# EAGLE design art_limb (EAGLE 7.6.0)
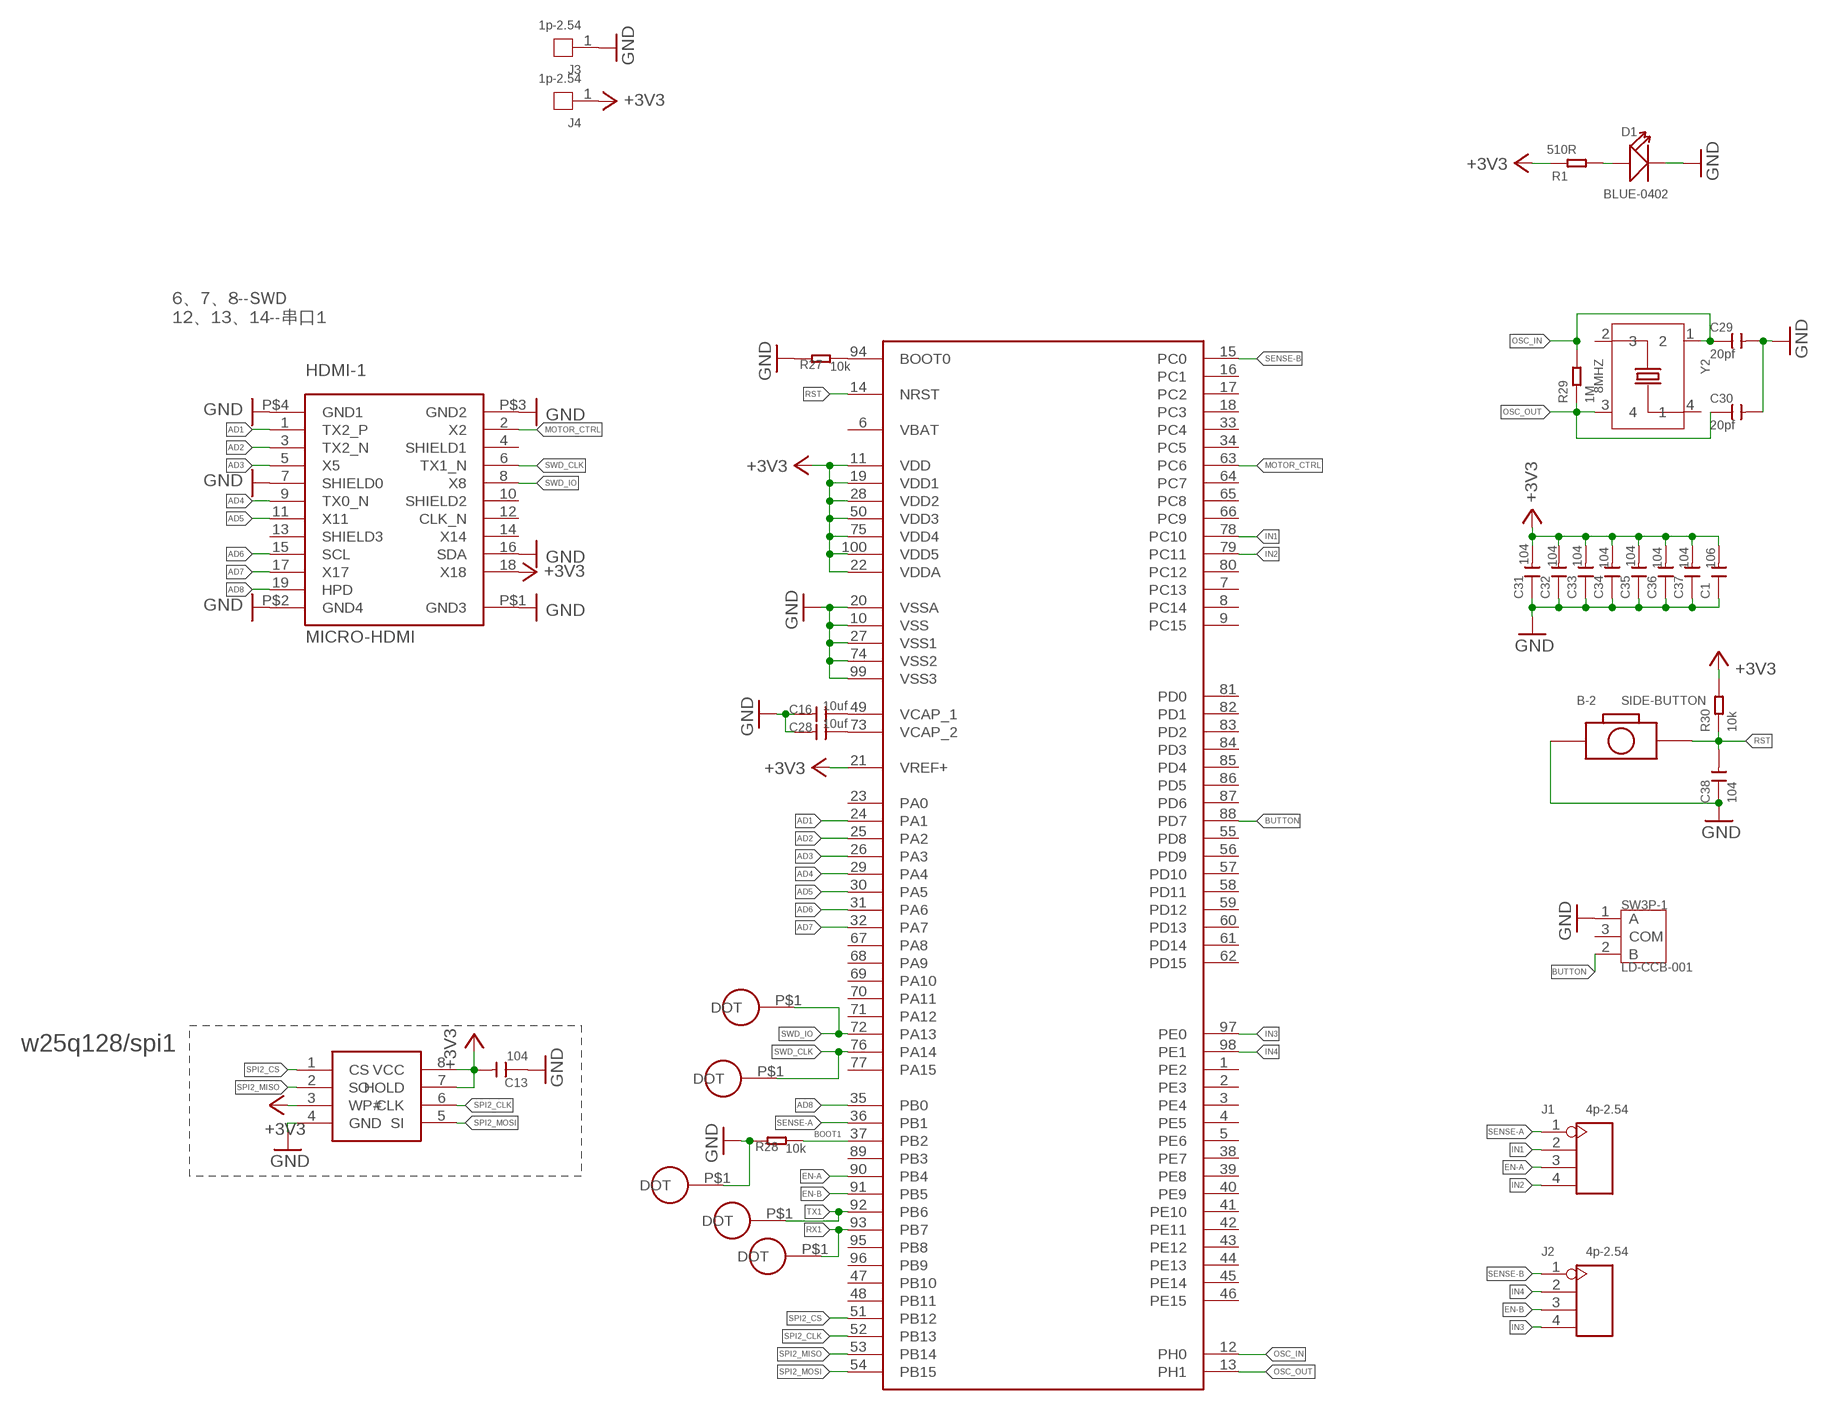
[diagram p0: schematic, sheet 1]

## Parts
B-2  SIDE-BUTTON  [SIDE-BUTTON]
C1  106  CAP-(0402)  [C0402]
C13  104  CAP-(0402)  [C0402]
C16  10uf  CAP-(0402)  [C0402]
C28  10uf  CAP-(0402)  [C0402]
C29  20pf  CAP-(0402)  [C0402]
C30  20pf  CAP-(0402)  [C0402]
C31  104  CAP-(0402)  [C0402]
C32  104  CAP-(0402)  [C0402]
C33  104  CAP-(0402)  [C0402]
C34  104  CAP-(0402)  [C0402]
C35  104  CAP-(0402)  [C0402]
C36  104  CAP-(0402)  [C0402]
C37  104  CAP-(0402)  [C0402]
C38  104  CAP-(0402)  [C0402]
D1  BLUE-0402  LED-(0402)  [LED-0402]
HDMI-1  MICRO-HDMI  [HDMI]
J1  4p-2.54  DIP-BLACK-FEMALE-HEADER-VERT(4P-2.54)  [H4-2.54]
J2  4p-2.54  DIP-BLACK-FEMALE-HEADER-VERT(4P-2.54)  [H4-2.54]
J3  1p-2.54  DIP-BLACK-ROUND-FEMALE-HEADER-VERT(1P-2.54)  [1P-65/35MIL]
J4  1p-2.54  DIP-BLACK-ROUND-FEMALE-HEADER-VERT(1P-2.54)  [1P-65/35MIL]
R1  510R  RES-(0402)  [R0402]
R27  10k  RES-(0402)  [R0402]
R28  10k  RES-(0402)  [R0402]
R29  1M  RES-(0402)  [R0402]
R30  10k  RES-(0402)  [R0402]
SW3P-1  LD-CCB-001  SWITCH(3P)  [SW3-2.54-9.0X3.5X3.5+2.0MM]
U$1  STM32F40XSTM32D40X  [LQFP100]
U$2  TEST-POINT  [TEST-POINT]
U$3  TEST-POINT  [TEST-POINT]
U$4  TEST-POINT  [TEST-POINT]
U$5  TEST-POINT  [TEST-POINT]
U$6  TEST-POINT  [TEST-POINT]
W25Q128  W25Q128  [SOP08]
Y2  8MHZ  SMD-CRYSTAL-27.12MHZ-18PF-30PPM-60R(4P-3.2X2.5MM)  [X4-SMD-3.2X2.5X0.7MM]

## Nets
+3V3: C1.2 C13.2 C31.2 C32.2 C33.2 C34.2 C35.2 C36.2 C37.2 HDMI-1.18(X18) J4.1 R1.2 R30.2 U$1.11(VDD) U$1.19(VDD1) U$1.21(VREF+) U$1.22(VDDA) U$1.28(VDD2) U$1.50(VDD3) U$1.75(VDD4) U$1.100(VDD5) W25Q128.3(WP#) W25Q128.7(HOLD) W25Q128.8(VCC)
AD1: HDMI-1.1(TX2_P) U$1.24(PA1)
AD2: HDMI-1.3(TX2_N) U$1.25(PA2)
AD3: HDMI-1.5(X5) U$1.26(PA3)
AD4: HDMI-1.9(TX0_N) U$1.29(PA4)
AD5: HDMI-1.11(X11) U$1.30(PA5)
AD6: HDMI-1.15(SCL) U$1.31(PA6)
AD7: HDMI-1.17(X17) U$1.32(PA7)
AD8: HDMI-1.19(HPD) U$1.35(PB0)
BOOT1: R28.2 U$1.37(PB2)
BUTTON: SW3P-1.2(B) U$1.88(PD7)
EN-A: J1.3 U$1.90(PB4)
EN-B: J2.3 U$1.91(PB5)
GND: B-2.P$2 C1.1 C13.1 C16.2 C28.2 C29.2 C30.2 C31.1 C32.1 C33.1 C34.1 C35.1 C36.1 C37.1 C38.1 D1.- HDMI-1.7(SHIELD0) HDMI-1.16(SDA) HDMI-1.P$1(GND3) HDMI-1.P$2(GND4) HDMI-1.P$3(GND2) HDMI-1.P$4(GND1) J3.1 R27.1 R28.1 SW3P-1.1(A) U$1.10(VSS) U$1.20(VSSA) U$1.27(VSS1) U$1.74(VSS2) U$1.99(VSS3) U$4.P$1(DOT) W25Q128.4(GND)
IN1: J1.2 U$1.78(PC10)
IN2: J1.4 U$1.79(PC11)
IN3: J2.4 U$1.97(PE0)
IN4: J2.2 U$1.98(PE1)
MOTOR_CTRL: HDMI-1.2(X2) U$1.63(PC6)
N$1: D1.+ R1.1
N$21: C16.1 U$1.49(VCAP_1)
N$22: C28.1 U$1.73(VCAP_2)
N$23: R27.2 U$1.94(BOOT0)
OSC_IN: C29.1 R29.2 U$1.12(PH0) Y2.1
OSC_OUT: C30.1 R29.1 U$1.13(PH1) Y2.3
RST: B-2.P$1 C38.2 R30.1 U$1.14(NRST)
RX1: U$1.93(PB7) U$2.P$1(DOT)
SENSE-A: J1.1 U$1.36(PB1)
SENSE-B: J2.1 U$1.15(PC0)
SPI2_CLK: U$1.52(PB13) W25Q128.6(CLK)
SPI2_CS: U$1.51(PB12) W25Q128.1(CS)
SPI2_MISO: U$1.53(PB14) W25Q128.2(SO)
SPI2_MOSI: U$1.54(PB15) W25Q128.5(SI)
SWD_CLK: HDMI-1.6(TX1_N) U$1.76(PA14) U$6.P$1(DOT)
SWD_IO: HDMI-1.8(X8) U$1.72(PA13) U$5.P$1(DOT)
TX1: U$1.92(PB6) U$3.P$1(DOT)
Unconnected: HDMI-1.4(SHIELD1) HDMI-1.10(SHIELD2) HDMI-1.12(CLK_N) HDMI-1.13(SHIELD3) HDMI-1.14(X14) SW3P-1.3(COM) U$1.1(PE2) U$1.2(PE3) U$1.3(PE4) U$1.4(PE5) U$1.5(PE6) U$1.6(VBAT) U$1.7(PC13) U$1.8(PC14) U$1.9(PC15) U$1.16(PC1) U$1.17(PC2) U$1.18(PC3) U$1.23(PA0) U$1.33(PC4) U$1.34(PC5) U$1.38(PE7) U$1.39(PE8) U$1.40(PE9) U$1.41(PE10) U$1.42(PE11) U$1.43(PE12) U$1.44(PE13) U$1.45(PE14) U$1.46(PE15) U$1.47(PB10) U$1.48(PB11) U$1.55(PD8) U$1.56(PD9) U$1.57(PD10) U$1.58(PD11) U$1.59(PD12) U$1.60(PD13) U$1.61(PD14) U$1.62(PD15) U$1.64(PC7) U$1.65(PC8) U$1.66(PC9) U$1.67(PA8) U$1.68(PA9) U$1.69(PA10) U$1.70(PA11) U$1.71(PA12) U$1.77(PA15) U$1.80(PC12) U$1.81(PD0) U$1.82(PD1) U$1.83(PD2) U$1.84(PD3) U$1.85(PD4) U$1.86(PD5) U$1.87(PD6) U$1.89(PB3) U$1.95(PB8) U$1.96(PB9) Y2.2 Y2.4

## Notes on the sheet
- 6、7、8--SWD
  12、13、14--串口1
- w25q128/spi1

## Library data of the parts
B-2 = 1-LDA_Board:SIDE-BUTTON
C1 C13 C16 C28-C38 = 1-LDA_Board:CAP-(0402): 302010041; MPN: GRM1555C1H150JA01D; VALUE: 15pf
D1 = 1-LDA_Board:LED-(0402): 304090075; MPN: BL-HB337A-AV-TRB
HDMI-1 = 1-LDA_Board:MICRO-HDMI
J1 J2 = Seeed-OPL-Connector:DIP-BLACK-FEMALE-HEADER-VERT(4P-2.54): 320030017; MPN: F185-1104A1BSYA1
J3 J4 = Seeed-OPL-Connector:DIP-BLACK-ROUND-FEMALE-HEADER-VERT(1P-2.54): 320030026; MPN: RF130-1013BBS0741
R1 R27-R30 = 1-LDA_Board:RES-(0402): 301010000; MPN: RC0402JR-070RL; VALUE: 0R
SW3P-1 = 1-LDA_Board:SWITCH(3P): 311030006; MPN: LD-CCB-001
U$1 = 1-LDA_Board:STM32F40X: Features • Core: ARM 32-bit Cortex™-M4 CPU with FPU, Adaptive real-time accelerator (ART Accelerator™) allowing 0-wait state execution from Flash memory, frequency up to 168 MHz, memory protection unit, 210 DMIPS/ 1.25 DMIPS/MHz (Dhrystone 2.1), and DSP instructions • Memories – Up to 1 Mbyte of Flash memory – Up to 192+4 Kbytes of SRAM including 64- Kbyte of CCM (core coupled memory) data RAM – Flexible static memory controller supporting Compact Flash, SRAM, PSRAM, NOR and NAND memories • LCD parallel interface, 8080/6800 modes • Clock, reset and supply management – 1.8 V to 3.6 V application supply and I/Os – POR, PDR, PVD and BOR – 4-to-26 MHz crystal oscillator – Internal 16 MHz factory-trimmed RC (1% accuracy) – 32 kHz oscillator for RTC with calibration – Internal 32 kHz RC with calibration • Low power – Sleep, Stop and Standby modes – VBAT supply for RTC, 20×32 bit backup registers + optional 4 KB backup SRAM • 3×12-bit, 2.4 MSPS A/D converters: up to 24 channels and 7.2 MSPS in triple interleaved mode • 2×12-bit D/A converters • General-purpose DMA: 16-stream DMA controller with FIFOs and burst support • Up to 17 timers: up to twelve 16-bit and two 32- bit timers up to 168 MHz, each with up to 4 IC/OC/PWM or pulse counter and quadrature (incremental) encoder input • Debug mode – Serial wire debug (SWD) & JTAG interfaces – Cortex-M4 Embedded Trace Macrocell™ • Up to 140 I/O ports with interrupt capability – Up to 136 fast I/Os up to 84 MHz – Up to 138 5 V-tolerant I/Os • Up to 15 communication interfaces – Up to 3 × I2C interfaces (SMBus/PMBus) – Up to 4 USARTs/2 UARTs (10.5 Mbit/s, ISO 7816 interface, LIN, IrDA, modem control) – Up to 3 SPIs (42 Mbits/s), 2 with muxed full-duplex I2S to achieve audio class accuracy via internal audio PLL or external clock – 2 × CAN interfaces (2.0B Active) – SDIO interface • Advanced connectivity – USB 2.0 full-speed device/host/OTG controller with on-chip PHY – USB 2.0 high-speed/full-speed device/host/OTG controller with dedicated DMA, on-chip full-speed PHY and ULPI – 10/100 Ethernet MAC with dedicated DMA: supports IEEE 1588v2 hardware, MII/RMII • 8- to 14-bit parallel camera interface up to 54 Mbytes/s • True random number generator • CRC calculation unit • 96-bit unique ID • RTC: subsecond accuracy, hardware calendar
U$2-U$6 = 1-BT4:TEST-POINT
W25Q128 = 1-LDA_Board:W25Q128
Y2 = 1-LDA_Board:SMD-CRYSTAL-27.12MHZ-18PF-30PPM-60R(4P-3.2X2.5MM): 306010027; MPN: 7M-27.120MAAJ-T; VALUE: 27.12MHZ

## Board
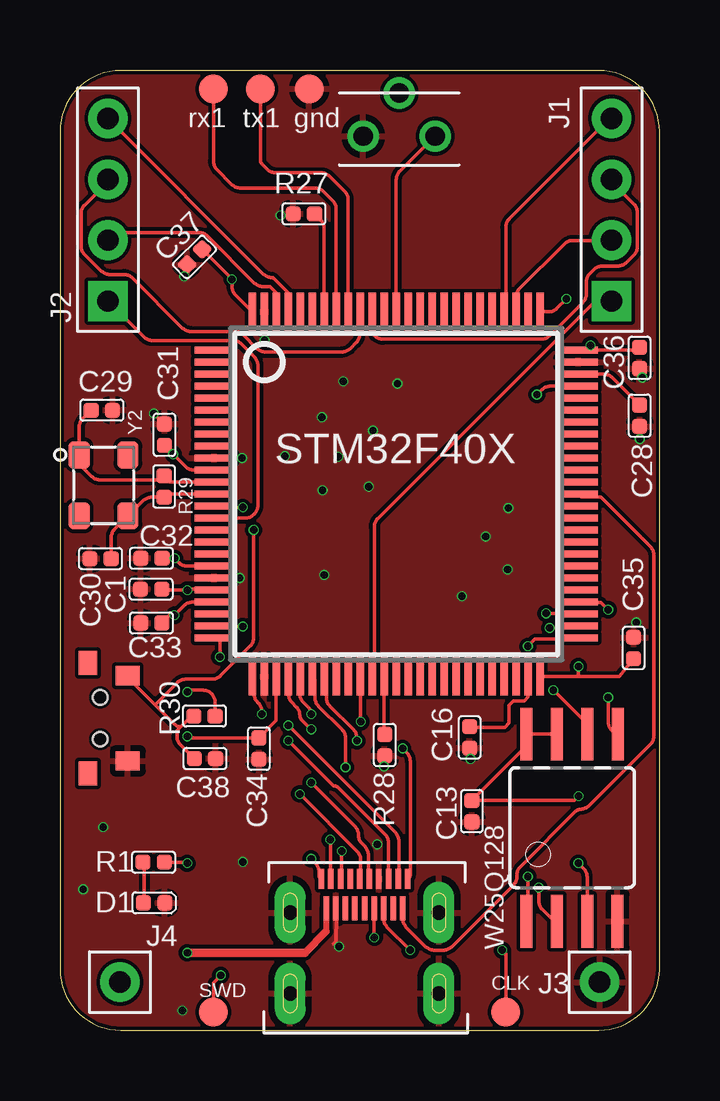
[diagram p1: board, top side]
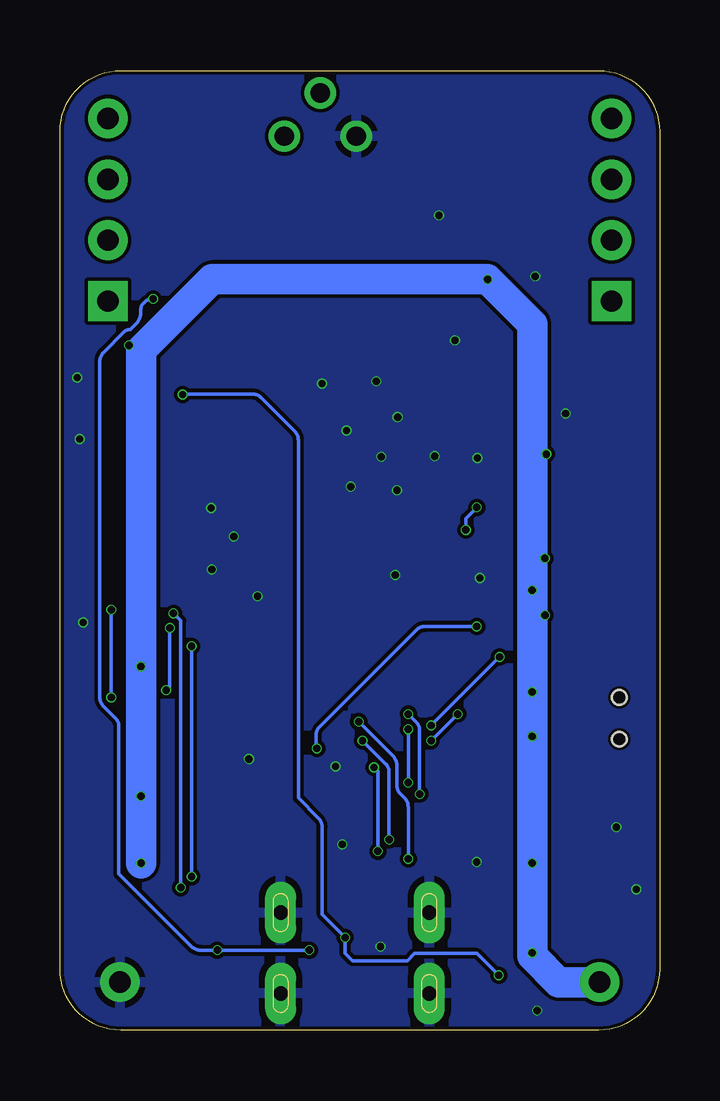
[diagram p2: board, bottom side, seen from below]

Size 25 x 40 mm. Coordinates in mm from the lower left corner, seen from the top.
Outline: 25,2.54 25,37.46 arc90 22.46,40 2.54,40 arc90 0,37.46 0,2.54 arc90 2.54,0 22.46,0 arc90 25,2.54
Copper layers (1*16): Top 0.035mm / dielectric 1.5mm / Bottom 0.035mm
Design rules "default *": minimum track width 6mil, minimum drill 12mil, track to track 6mil, track to pad 6mil, pad to pad 6mil, via to via 6mil, smd to smd 6mil, copper to edge 6mil, drill to drill 8mil, minimum pad ring 10mil, minimum via ring 2mil, stop-mask expansion 4mil, vias tented up to drill 12mil, thermal gap 10mil

### Footprints (pad centres in the part's own frame; a part is rotated, then mirrored left to right if it is on the bottom)
SIDE-BUTTON = smd 0.8 x 1: P$1 -1.778,1.15; P$2 1.778,1.15 | smd 1 x 0.762: P$3 2.3,-0.508; P$4 -2.3,-0.508 | hole 0.6: 0.87,0; -0.87,0
C0402 = smd 0.635 x 0.635: 1 0,0.445; 2 0,-0.445
LED-0402 = smd 0.635 x 0.635: + -0.445,0; - 0.445,0
HDMI = smd 0.23 x 0.85: 1 1.8,1.225; 3 1.4,1.225; 5 1,1.225; 7 0.6,1.225; 9 0.2,1.225; 11 -0.2,1.225; 13 -0.6,1.225; 15 -1,1.225; 17 -1.4,1.225; 19 -1.8,1.225 | smd 0.23 x 1: 2 1.6,0; 4 1.2,0; 6 0.8,0; 8 0.4,0; 10 0,0; 12 -0.4,0; 14 -0.8,0; 16 -1.2,0; 18 -1.6,0 | drill 0.6 pad 1.3 long: P$1 -3.1,-0.18; P$2 3.1,-0.18; P$3 -3.1,-3.55; P$4 3.1,-3.55
H4-2.54 = drill 0.889 pad 1.651 square: 1 0,3.81 | drill 0.889 pad 1.651: 2 0,1.27; 3 0,-1.27; 4 0,-3.81
1P-65/35MIL = drill 0.889 pad 1.651: 1 0,0
R0402 = smd 0.635 x 0.635: 1 0,0.445; 2 0,-0.445
SW3-2.54-9.0X3.5X3.5+2.0MM = drill 0.8 pad 1.3: 1 -1.5,-1.8; 2 1.5,-1.8 | drill 0.8: 3 0,0
LQFP100 = smd 1.6 x 0.3: 1 -7.6,6; 2 -7.6,5.5; 3 -7.6,5; 4 -7.6,4.5; 5 -7.6,4; 6 -7.6,3.5; 7 -7.6,3; 8 -7.6,2.5; 9 -7.6,2; 10 -7.6,1.5; 11 -7.6,1; 12 -7.6,0.5; 13 -7.6,0; 14 -7.6,-0.5; 15 -7.6,-1; 16 -7.6,-1.5; 17 -7.6,-2; 18 -7.6,-2.5; 19 -7.6,-3; 20 -7.6,-3.5; 21 -7.6,-4; 22 -7.6,-4.5; 23 -7.6,-5; 24 -7.6,-5.5; 25 -7.6,-6; 51 7.6,-6; 52 7.6,-5.5; 53 7.6,-5; 54 7.6,-4.5; 55 7.6,-4; 56 7.6,-3.5; 57 7.6,-3; 58 7.6,-2.5; 59 7.6,-2; 60 7.6,-1.5; 61 7.6,-1; 62 7.6,-0.5; 63 7.6,0; 64 7.6,0.5; 65 7.6,1; 66 7.6,1.5; 67 7.6,2; 68 7.6,2.5; 69 7.6,3; 70 7.6,3.5; 71 7.6,4; 72 7.6,4.5; 73 7.6,5; 74 7.6,5.5; 75 7.6,6 | smd 0.3 x 1.6: 26 -6,-7.6; 27 -5.5,-7.6; 28 -5,-7.6; 29 -4.5,-7.6; 30 -4,-7.6; 31 -3.5,-7.6; 32 -3,-7.6; 33 -2.5,-7.6; 34 -2,-7.6; 35 -1.5,-7.6; 36 -1,-7.6; 37 -0.5,-7.6; 38 0,-7.6; 39 0.5,-7.6; 40 1,-7.6; 41 1.5,-7.6; 42 2,-7.6; 43 2.5,-7.6; 44 3,-7.6; 45 3.5,-7.6; 46 4,-7.6; 47 4.5,-7.6; 48 5,-7.6; 49 5.5,-7.6; 50 6,-7.6; 76 6,7.6; 77 5.5,7.6; 78 5,7.6; 79 4.5,7.6; 80 4,7.6; 81 3.5,7.6; 82 3,7.6; 83 2.5,7.6; 84 2,7.6; 85 1.5,7.6; 86 1,7.6; 87 0.5,7.6; 88 0,7.6; 89 -0.5,7.6; 90 -1,7.6; 91 -1.5,7.6; 92 -2,7.6; 93 -2.5,7.6; 94 -3,7.6; 95 -3.5,7.6; 96 -4,7.6; 97 -4.5,7.6; 98 -5,7.6; 99 -5.5,7.6; 100 -6,7.6
TEST-POINT = smd 1.2 x 1.2: P$1 0,0
SOP08 = smd 0.5 x 2.2: 1 -1.905,-3.9; 2 -0.645,-3.9; 3 0.625,-3.9; 4 1.895,-3.9; 5 1.905,3.9; 6 0.635,3.9; 7 -0.635,3.9; 8 -1.905,3.9
X4-SMD-3.2X2.5X0.7MM = smd 1.143 x 0.889: 1 -1.27,-1.016; 2 1.27,-1.016; 3 1.27,1.016; 4 -1.27,1.016

### Placement (x,y rotation side)
B-2  1.68,13 270 top
C1  3.8,18.38 90 top
C13  17.18,9.13 180 top
C16  17.08,12.2 0 top
C28  24.17,25.61 0 top
C29  1.75,25.85 90 top
C30  1.69,19.66 270 top
C31  4.36,24.82 0 top
C32  3.81,19.67 90 top
C33  3.81,16.97 90 top
C34  8.29,11.73 180 top
C35  23.92,15.93 0 top
C36  24.17,28.02 180 top
C37  5.61,32.23 135 top
C38  6.05,11.32 270 top
D1  3.92,5.31 0 top
HDMI-1  12.7,5.08 0 top
J1  23,34.2 180 top
J2  2,34.2 180 top
J3  22.5,2 0 top
J4  2.5,2 0 top
R1  3.9,7 90 top
R27  10.17,34.03 90 top
R28  13.54,11.89 180 top
R29  4.34,22.66 180 top
R30  6.03,13.1 90 top
SW3P-1  14.14,39.06 0 top
U$1  14.02,22.35 0 top
U$2  6.4,39.24 0 top
U$3  8.36,39.24 0 top
U$4  10.39,39.24 0 top
U$5  6.4,0.76 0 top
U$6  18.59,0.76 0 top
W25Q128  21.35,8.44 0 top
Y2  1.82,22.71 270 top

### Tracks (layer width: path | path; a pad name or v marks a point on that pad's centre or on a via)
+3V3  (via drill 0.3 pad 0.41)
  Top 0.152: U$1.21 6.38,18.38 5.35,18.38 v5.31,18.34 4.29,18.34 C1.2 | U$1.28 9.02,12.9 C34.2 5.37,12.18 v5.31,12.24 | C35.2 23.33,14.75 U$1.50 21.62,14.75 v21.62,15.16 | C36.2 24.04,28.35 U$1.75 21.92,28.35 v22.12,28.55 | U$1.19 5.31,19.35 arc-45 4.95,19.49 v4.78,19.67 C32.2 | U$1.22 5.53,17.85 arc45 5.17,17.7 v4.78,17.3 4.58,17.3 C33.2 | U$1.11 5.6,23.35 arc-45 5.24,23.49 v4.72,24.01 C31.2 | C37.2 v7.17,31.3 7.17,31 arc45 7.32,30.65 U$1.100 | R30.2 6.47,13.66 arc90 5.96,14.17 5.38,14.17 v5.31,14.1 | R1.2 5.27,7 v5.31,6.96 | W25Q128.3 21.98,6.38 arc45 21.83,6.74 v21.61,6.96 | W25Q128.7 W25Q128.8 19.45,11.85 C13.2 21.44,9.57 v21.62,9.75
  Top 0.254: HDMI-1.18 11.1,4.12
  Top 0.305: 11.1,4.12 10.21,3.23
  Top 0.356: 10.21,3.23 v5.31,3.23
  Bottom 0.152: v4.78,19.67 4.88,19.66 5.31,19.66 | U$1.75 22.1,28.65 v22.12,28.55 | v4.78,17.3 4.88,17.37 5.31,17.37 | v4.72,24.01 4.72,24.08 5.31,24.08
  Bottom 1.27: J4.1 4.21,2 5.31,3.1 v5.31,3.23 v5.31,6.96 v5.31,12.24 v5.31,14.1 5.31,17.37 v5.31,18.34 5.31,19.66 5.31,24.08 5.31,29.44 v7.17,31.3 18.66,31.3 U$1.75 v21.62,15.16 v21.62,9.75 v21.62,6.96 v21.61,6.96
AD1  (via drill 0.3)
  Top 0.152: v14.29,11.75 14.46,11.58 arc-45 14.61,11.22 14.61,6.46 arc-67 HDMI-1.1 | v7.62,16.83 6.51,16.83 U$1.24
  Bottom 0.152: v7.62,16.83 9.78,16.83 arc-45 10.14,16.68 14.18,12.65 arc-45 14.33,12.29 14.33,11.79 v14.29,11.75
AD2  (via drill 0.3)
  Top 0.152: v9.53,12.7 13.98,8.24 arc-45 14.13,7.89 14.13,6.35 HDMI-1.3 | v6.67,15.56 6.67,16.19 6.51,16.35 U$1.25
  Bottom 0.152: v6.67,15.56 v9.53,12.7
AD3  (via drill 0.3)
  Top 0.152: v8.41,13.18 8.41,13.28 arc45 8.27,13.64 8.24,13.66 arc-45 8.1,14.02 8.1,14.61 U$1.26 | HDMI-1.5 13.7,7.81 arc45 13.55,8.17 11.62,10.1 arc45 11.4,10.19 v9.53,12.06
  Bottom 0.152: v8.41,13.18 v9.53,12.06
AD4  (via drill 0.3)
  Top 0.152: v10.48,12.54 10.08,12.94 arc-45 10,13.12 arc45 9.85,13.48 9.67,13.66 arc-45 9.53,14.02 9.53,14.61 U$1.29 | HDMI-1.9 12.86,6.35 12.86,7.3 arc45 12.71,7.66 12.6,7.78 arc-45 12.45,8.13 12.45,8.14 arc45 12.3,8.5 v10.48,10.32
  Bottom 0.152: v10.48,12.54 v10.48,10.32
AD5  (via drill 0.3)
  Top 0.152: v10,9.84 12.39,7.45 arc-45 12.54,7.09 12.54,6.35 HDMI-1.11 | v10.48,13.18 arc45 10.37,13.45 10.15,13.66 arc-45 10,14.02 10,14.61 U$1.30
  Bottom 0.152: v10.48,13.18 10.15,12.85 arc45 10,12.49 v10,9.84
AD6  (via drill 0.3)
  Top 0.152: v11.75,7.46 11.75,6.35 HDMI-1.15 | v11.91,10.95 11.91,12.17 arc45 11.76,12.53 10.79,13.5 arc-45 10.64,13.86 10.64,14.61 U$1.31
  Bottom 0.152: v11.75,7.46 11.75,10.79 v11.91,10.95
AD7  (via drill 0.3)
  Top 0.152: v11.27,7.94 11.27,6.35 HDMI-1.17 | v12.38,12.06 12.38,12.17 arc45 12.23,12.53 11.26,13.5 arc-45 11.11,13.86 11.11,14.61 U$1.32
  Bottom 0.152: v12.38,12.06 11.42,11.1 arc45 11.27,10.74 v11.27,7.94
AD8  (via drill 0.3)
  Top 0.152: v10.48,7.14 10.65,6.97 arc-45 10.79,6.62 10.79,6.46 arc67 HDMI-1.19 | v12.54,12.86 12.54,14.61 U$1.35
  Bottom 0.152: v12.54,12.86 11.1,11.42 arc45 10.95,11.06 10.95,10.21 arc-45 10.8,9.85 10.63,9.67 arc45 10.48,9.31 v10.48,7.14
BOOT1
  Top 0.152: U$1.37 13.52,12.35 R28.2
BUTTON
  Top 0.152: U$1.88 14.02,35.45 arc-45 14.17,35.81 15.54,37.19 SW3P-1.2
EN-A
  Top 0.152: U$1.90 13.11,29.87 13.11,28.96 arc45 13.11,28.95 arc45 13.47,28.8 20.06,28.8 arc45 20.42,28.95 21.8,30.33 arc45 21.95,30.69 21.95,31.18 arc-45 22.09,31.54 22.25,31.7 arc-45 22.61,31.85 23.26,31.85 arc45 23.62,32 23.93,32.31 arc45 24.08,32.67 24.08,34.08 arc45 23.93,34.44 23.01,35.36 J1.3
EN-B
  Top 0.152: U$1.91 12.5,29.88 12.5,29.02 arc-45 12.35,28.66 12.11,28.42 arc-45 11.75,28.27 8.56,28.27 arc-45 8.21,28.42 7.65,28.98 arc45 7.29,29.12 5.46,29.12 arc-45 5.1,29.27 3.02,31.35 arc45 2.67,31.5 2.08,31.5 arc-45 1.73,31.65 1,32.38 arc-45 0.88,32.67 0.88,34.04 arc-45 1.02,34.4 2,35.38 J2.3
GND  (via drill 0.3 pad 0.41)
  Top 0.152: U$1.99 8.52,28.77 v8.53,28.75 | 11.4,3.61 11.5,3.7 11.5,4.21 11.53,4.24 11.53,5.05 HDMI-1.16 | C36.1 24.28,27.46 v24.28,27.2 | C31.1 v3.91,25.7
  other vias: 10.92,25.55 5.18,31.42 9.19,33.96 7.49,18.85 13.51,11 17.12,11.3 24.03,16.99 11.63,3.48 13.23,7.75 24.18,24.64 14.07,26.95 13.06,24.99 10.95,22.5 9.37,23.93 11.61,23.9 12.88,22.66 11.81,27.05 17.75,20.57 18.69,21.77 18.67,19.2 16.76,18.08 11.02,18.97 1.8,8.46 7.62,7.01 0.97,5.87 5.11,0.81 7.59,23.85
  pour Top: -3.96,43.64 27.76,43.64 27.76,-2.84 -3.96,-2.84
  pour Bottom: -4.47,43.61 31.29,43.61 31.29,-1.32 -4.47,-1.32
IN1
  Top 0.152: U$1.78 19.05,30.02 19.05,30.68 arc-45 19.12,30.86 21.04,32.77 arc-45 21.39,32.92 22.86,32.92 J1.2
IN2
  Top 0.152: U$1.79 18.59,30.02 18.59,33.47 arc-45 18.74,33.83 22.86,37.95 J1.4
IN3
  Top 0.152: U$1.97 9.5,30 9.5,30.75 8.9,31.35 arc45 8.84,31.38 arc-45 8.48,31.52 J2.4
IN4
  Top 0.152: J2.2 arc-90 2.32,33.25 5.79,33.25 arc-45 6.15,33.1 8.1,31.15 arc45 8.46,31 8.75,31 9,30.75 9,30 U$1.98
MOTOR_CTRL
  Top 0.152: HDMI-1.2 14.29,5.08 14.29,4.66 arc45 14.44,4.3 15.25,3.48 arc45 15.61,3.33 15.98,3.33 arc45 16.34,3.48 18.9,6.04 arc45 19.05,6.4 19.05,6.46 arc-45 19.2,6.82 21.51,9.13 arc-45 21.7,9.21 arc45 22.06,9.36 24.62,11.92 arc45 24.77,12.28 24.77,19.79 arc45 24.62,20.15 22.54,22.23 21.75,22.23 U$1.63
N$1
  Top 0.152: D1.+ 3.5,5.33 3.5,6.86 R1.1
N$21
  Top 0.152: U$1.49 19.52,13.88 19.36,13.72 18.9,13.72 18.72,13.54 18.72,12.8 18.54,12.62 17.11,12.62 C16.1
N$22
  Top 0.152: U$1.73 22.67,27.35 arc-45 23.03,27.2 C28.1
N$23
  Top 0.152: R27.2 10.87,33.77 arc-45 11.02,33.41 U$1.94
OSC_IN
  Top 0.152: U$1.12 4.6,22.85 R29.2 4.17,22.94 1.68,22.94 arc-45 1.32,23.09 0.8,23.61 Y2.1 0.8,25.13 arc-45 0.95,25.49 C29.1
OSC_OUT
  Top 0.152: U$1.13 4.47,22.35 R29.1 3.83,22.22 arc45 3.47,22.07 Y2.3 2.29,20.89 arc45 2.14,20.53 C30.1
RST  (via drill 0.3 pad 0.41)
  Top 0.152: 5.03,12.65 5.49,13.11 R30.1 | 5.03,12.65 4.88,12.5 4.88,12.25 arc45 5.03,11.89 5.49,11.43 C38.2 | 5.03,12.65 arc-45 4.77,12.76 3.96,13.56 | 3.96,13.56 2.9,14.63 B-2.P$1 | v8.08,20.85 8.08,16.36 arc-45 7.93,16.01 6.7,14.78 arc-45 6.34,14.63 5.24,14.63 arc45 4.88,14.48 3.96,13.56 | U$1.14 6.55,21.79 v7.62,21.79
  Bottom 0.152: v8.08,20.85 8.08,21.34 v7.62,21.79
RX1
  Top 0.152: U$2.P$1 6.4,36.23 arc45 6.55,35.87 7.17,35.25 arc45 7.53,35.1 10.63,35.1 arc-45 10.99,34.95 11.37,34.58 arc-45 11.52,34.22 U$1.93
SENSE-A
  Top 0.152: U$1.36 13.11,14.78 13.11,20.97 arc-45 13.26,21.33 22.25,30.33 22.86,30.33 J1.1
SENSE-B
  Top 0.152: U$1.15 7.72,21.35 arc45 8.08,21.49 8.11,21.52 arc45 8.26,21.88 8.26,27.7 arc45 8.11,28.06 7.57,28.6 arc45 7.21,28.75 3.85,28.75 arc-45 3.49,28.9 J2.1
SPI2_CLK  (via drill 0.3)
  Top 0.152: v20.42,16.76 21.49,16.76 U$1.52 | v20.57,14.17 21.95,12.8 21.95,12.34 W25Q128.6
  Bottom 0.152: v20.42,16.76 20.42,14.33 v20.57,14.17
SPI2_CS  (via drill 0.3)
  Top 0.152: v19.51,16 19.81,16.31 21.49,16.31 U$1.51 | v19.51,6.4 19.51,4.57 W25Q128.1
  Bottom 0.152: v19.51,6.4 v19.51,16
SPI2_MISO  (via drill 0.3)
  Top 0.152: v20.27,17.37 21.49,17.37 U$1.53 | v19.96,5.94 19.96,5.39 arc45 20.11,5.03 20.57,4.57 W25Q128.2
  Bottom 0.152: v20.27,17.37 19.96,17.07 v19.96,5.94
SPI2_MOSI  (via drill 0.3)
  Top 0.152: v22.86,17.53 22.55,17.83 21.64,17.83 U$1.54 | v22.86,13.87 22.86,12.86 arc45 23.01,12.5 23.16,12.34 W25Q128.5
  Bottom 0.152: v22.86,13.87 v22.86,17.53
SWD_CLK  (via drill 0.3, 0.3 pad 0.41)
  Top 0.152: v14.61,3.33 13.64,4.3 arc-45 13.49,4.66 HDMI-1.6 | v21.11,30.48 20.73,30.09 arc-45 20.37,29.95 U$1.76 | U$6.P$1 18.59,3.18 v18.44,3.33
  Bottom 0.152: v14.61,3.33 v18.44,3.33 19.16,3.33 arc45 19.52,3.48 22.54,6.51 22.54,12.65 arc-45 22.69,13.01 23.19,13.5 arc45 23.34,13.86 23.34,27.89 arc45 23.19,28.25 22.34,29.1 arc45 22.07,29.21 21.79,29.49 arc-45 21.64,29.85 21.64,29.97 arc90 21.13,30.48 v21.11,30.48
SWD_IO  (via drill 0.3 pad 0.41)
  Top 0.152: U$1.72 20.45,26.85 arc45 20.09,26.7 v19.89,26.49 | HDMI-1.8 v13.1,3.87 v13.11,3.86 | U$5.P$1 6.4,1.98 v6.71,2.29
  Bottom 0.152: v19.89,26.49 19.86,26.52 16.97,26.52 arc45 16.61,26.37 15.21,24.96 arc45 15.06,24.61 15.06,9.68 14.22,8.84 arc45 14.07,8.48 14.07,4.83 v13.11,3.86 13.11,3.2 12.8,2.9 10.52,2.9 10.21,3.2 7.62,3.2 v6.71,2.29
TX1
  Top 0.152: U$3.P$1 8.36,36.29 arc45 8.44,36.08 8.64,35.89 arc45 9,35.74 10.89,35.74 arc-45 11.25,35.59 11.87,34.97 arc-45 12.02,34.61 U$1.92

### Text on the board
tPlace: rx1 | tx1 | gnd | CLK | SWD